# EAGLE design RH043.2 (EAGLE 7.7.0)
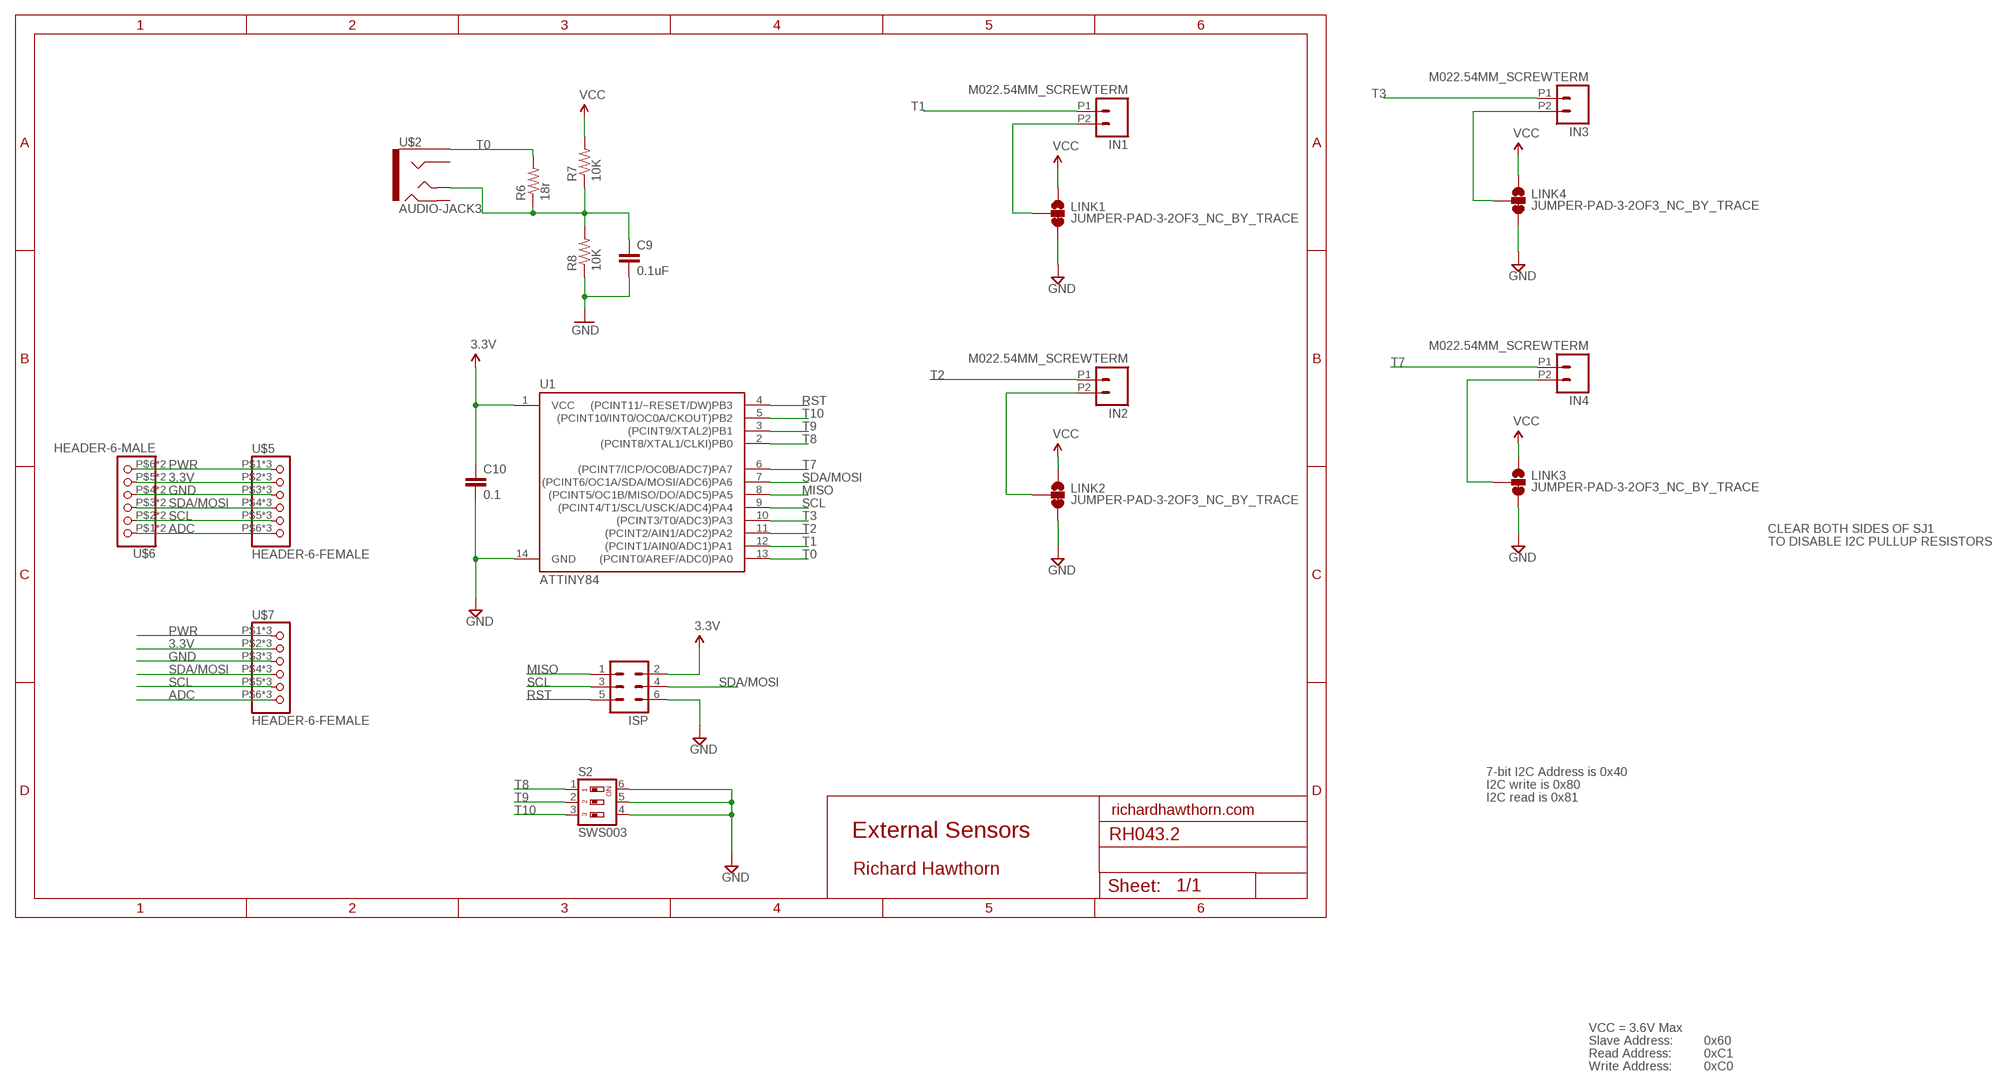
[diagram p0: schematic, sheet 1]

## Parts
C9  0.1uF  CAP0603-CAP  [0603-CAP]
C10  0.1  CAP0603-CAP  [0603-CAP]
IN1  M022.54MM_SCREWTERM  [1X02_2.54_SCREWTERM]
IN2  M022.54MM_SCREWTERM  [1X02_2.54_SCREWTERM]
IN3  M022.54MM_SCREWTERM  [1X02_2.54_SCREWTERM]
IN4  M022.54MM_SCREWTERM  [1X02_2.54_SCREWTERM]
ISP  MA03-2  [MA03-2]
LINK1  JUMPER-PAD-3-2OF3_NC_BY_TRACE  [PAD-JUMPER-3-2OF3_NC_BY_TRACE_YES_SILK_FULL_BOX]
LINK2  JUMPER-PAD-3-2OF3_NC_BY_TRACE  [PAD-JUMPER-3-2OF3_NC_BY_TRACE_YES_SILK_FULL_BOX]
LINK3  JUMPER-PAD-3-2OF3_NC_BY_TRACE  [PAD-JUMPER-3-2OF3_NC_BY_TRACE_YES_SILK_FULL_BOX]
LINK4  JUMPER-PAD-3-2OF3_NC_BY_TRACE  [PAD-JUMPER-3-2OF3_NC_BY_TRACE_YES_SILK_FULL_BOX]
R6  18r  RESISTOR0603-RES  [0603-RES]
R7  10K  RESISTOR0603-RES  [0603-RES]
R8  10K  RESISTOR0603-RES  [0603-RES]
S2  SWS003  [SMS-003]
U1  ATTINY84  [SO14]
U$2  AUDIO-JACK3  [AUDIO-JACK-TRRS-SMD]
U$5  HEADER-6-FEMALE  [2MMHEADER6]
U$6  HEADER-6-MALE  [2MMHEADERPIN6]
U$7  HEADER-6-FEMALE  [2MMHEADER6]

## Nets
3.3V: C10.1 ISP.2 LINK1.1 LINK2.1 LINK3.1 LINK4.1 R7.2 U1.1(VCC) U$5.P$2 U$5.P$10 U$5.P$18 U$6.P$5 U$6.P$13 U$7.P$2 U$7.P$10 U$7.P$18 ; supply symbol labelled VCC
ADC: U$5.P$6 U$5.P$14 U$5.P$22 U$6.P$1 U$6.P$9 U$7.P$6 U$7.P$14 U$7.P$22
GND [power]: C9.2 C10.2 ISP.6 LINK1.3 LINK2.3 LINK3.3 LINK4.3 R8.1 S2.4 S2.5 S2.6 U1.14(GND) U$5.P$3 U$5.P$11 U$5.P$19 U$6.P$4 U$6.P$12 U$7.P$3 U$7.P$11 U$7.P$19
MISO: ISP.1 U1.8((PCINT5/OC1B/MISO/DO/ADC5)PA5)
N$1 [power]: IN3.P2 LINK4.2
N$2 [power]: IN4.P2 LINK3.2
N$13 [power]: IN1.P2 LINK1.2
N$15 [power]: IN2.P2 LINK2.2
PWR [power]: U$5.P$1 U$5.P$9 U$5.P$17 U$6.P$6 U$6.P$14 U$7.P$1 U$7.P$9 U$7.P$17
R6: C9.1 R6.1 R7.1 R8.2 U$2.TIP
RST: ISP.5 U1.4((PCINT11/~RESET/DW)PB3)
SCL: ISP.3 U1.9((PCINT4/T1/SCL/USCK/ADC4)PA4) U$5.P$5 U$5.P$13 U$5.P$21 U$6.P$2 U$6.P$10 U$7.P$5 U$7.P$13 U$7.P$21
SDA/MOSI: ISP.4 U1.7((PCINT6/OC1A/SDA/MOSI/ADC6)PA6) U$5.P$4 U$5.P$12 U$5.P$20 U$6.P$3 U$6.P$11 U$7.P$4 U$7.P$12 U$7.P$20
T0: R6.2 U1.13((PCINT0/AREF/ADC0)PA0) U$2.EARTH
T1: IN1.P1 U1.12((PCINT1/AIN0/ADC1)PA1)
T2: IN2.P1 U1.11((PCINT2/AIN1/ADC2)PA2)
T3: IN3.P1 U1.10((PCINT3/T0/ADC3)PA3)
T7: IN4.P1 U1.6((PCINT7/ICP/OC0B/ADC7)PA7)
T8: S2.1 U1.2((PCINT8/XTAL1/CLKI)PB0)
T9: S2.2 U1.3((PCINT9/XTAL2)PB1)
T10: S2.3 U1.5((PCINT10/INT0/OC0A/CKOUT)PB2)
Unconnected: U$2.RING1 U$2.RING2

## Notes on the sheet
- CLEAR BOTH SIDES OF SJ1
- TO DISABLE I2C PULLUP RESISTORS
- 7-bit I2C Address is 0x40
- I2C write is 0x80
- I2C read is 0x81
- richardhawthorn.com
- External Sensors
- Richard Hawthorn
- VCC = 3.6V Max
- Slave Address: | 0x60
- Read Address: | 0xC1
- Write Address: | 0xC0

## Library data of the parts
C9 = SparkFun:CAP: Capacitor Standard 0603 ceramic capacitor, and 0.1" leaded capacitor.
C10 = LowPowerLab:CAP: Capacitor Standard 0603 ceramic capacitor, and 0.1" leaded capacitor.
IN1-IN4 = SparkFun-Connectors:M02: Standard 2-pin 0.1" header. Use with - straight break away headers ( PRT-00116) - right angle break away headers (PRT-00553) - swiss pins (PRT-00743) - machine pins (PRT-00117) - female headers (PRT-00115) Molex polarized connector foot print use with: PRT-08233 with associated crimp pins and housings. 2.54_SCREWTERM for use with PRT-10571. 3.5mm Screw Terminal footprints for PRT-08084 5mm Screw Terminal footprints for use with PRT-08432
ISP = Richards:MA03-2: PIN HEADER; OC_FARNELL: unknown; OC_NEWARK: unknown
LINK1-LINK4 = SparkFun-Passives:JUMPER-PAD-3-2OF3_NC_BY_TRACE
R6-R8 = SparkFun:RESISTOR: Resistor Basic schematic elements and footprints for 0603, 1206, and PTH resistors.
S2 = smd-special:SWS003: SMD Dip Switch 3 pol.
U1 = SparkFun-DigitalIC:ATTINY84: Atmel 14-pin 2/4/8kB flash uC
U$2 = SparkFun-Connectors:AUDIO-JACK3: Audio jack - 3.5mm TRRS variety - two rings.
U$5 U$7 = Richards:HEADER-6-FEMALE
U$6 = Richards:HEADER-6-MALE

## Net classes
1 power: width 0.381 mm, clearance 0.254 mm

## Board
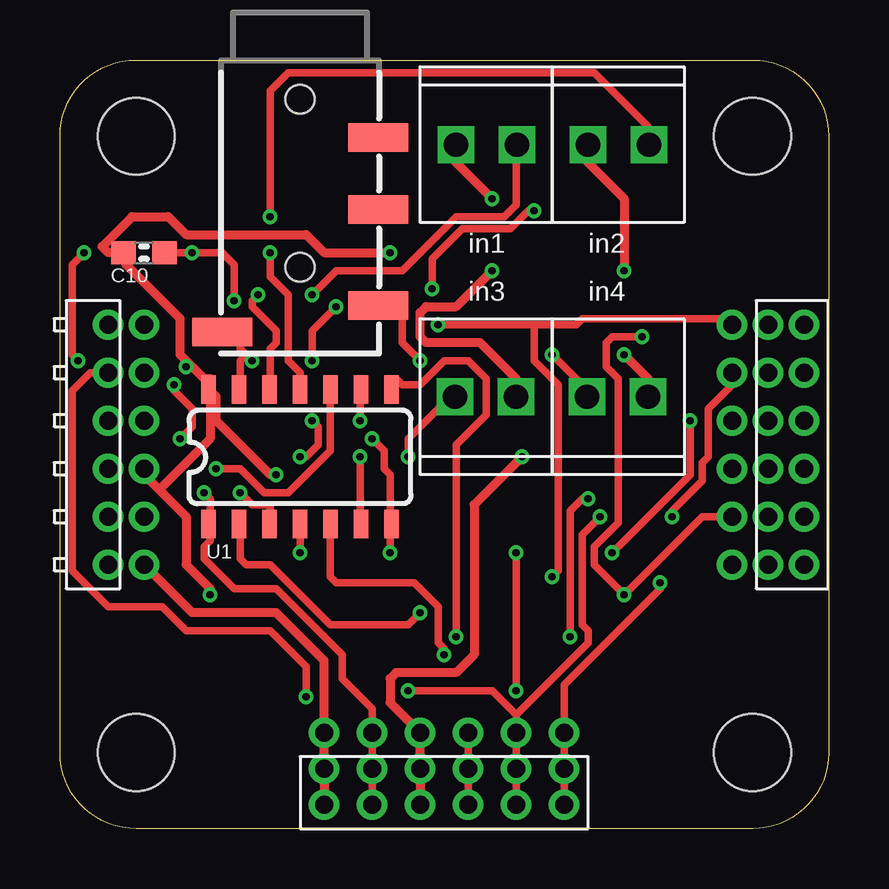
[diagram p1: board, top side]
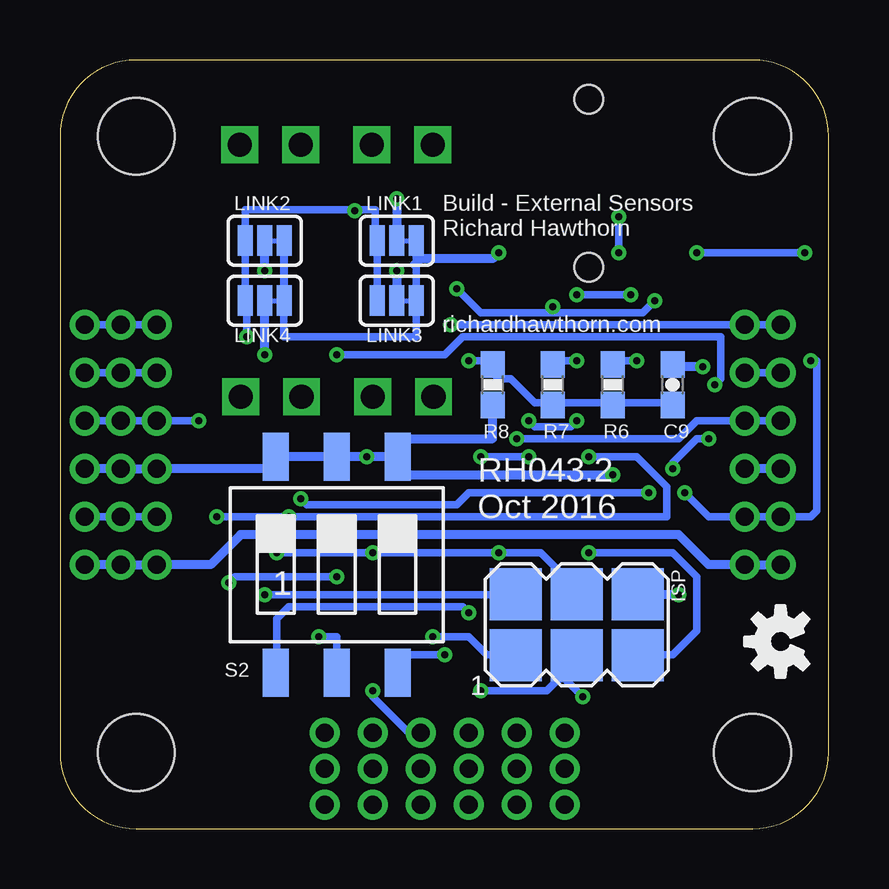
[diagram p2: board, bottom side, seen from below]

Size 32.03 x 32.03 mm. Coordinates in mm from the lower left corner, seen from the top.
Outline: 0,3.17 0,28.86 arc-90 3.17,32.03 28.86,32.03 arc-90 32.03,28.86 32.03,3.17 arc-90 28.86,0 3.17,0 arc-90 0,3.17
Copper layers (1*16): Top 0.035mm / dielectric 1.5mm / Bottom 0.035mm
Design rules "ITEADstudio_DRC *": minimum track width 12mil, minimum drill 12mil, track to track 6mil, track to pad 6mil, pad to pad 6mil, via to via 6mil, smd to smd 0mil, copper to edge 10mil, drill to drill 10mil, minimum pad ring 10mil, minimum via ring 6mil, stop-mask expansion 2mil, vias tented up to drill 100mil, thermal gap 15mil
Holes 3.2 mm at 3.17,3.17 28.86,3.17 3.17,28.86 28.86,28.86
tRestrict: area 0,0 to 5.7,5.7; area 26.3,0 to 32,5.7; area 26.3,26.3 to 32,32; area 0,26.3 to 5.7,32
bRestrict: area 0,26.3 to 5.7,32; area 26.3,26.3 to 32,32; area 26.3,0 to 32,5.7; area 0,0 to 5.7,5.7

### Footprints (pad centres in the part's own frame; a part is rotated, then mirrored left to right if it is on the bottom)
0603-CAP = smd 1.1 x 1: 1 -0.85,0; 2 0.85,0
0603-CAP' = smd 1.016 x 0.965: 1 -0.85,0; 2 0.85,0
1X02_2.54_SCREWTERM = drill 1.016 square: P1 2.54,0; P2 0,0
MA03-2 = smd 2.159 x 2.159: 1 -2.54,-1.27; 2 -2.54,1.27; 3 0,-1.27; 4 0,1.27; 5 2.54,-1.27; 6 2.54,1.27
PAD-JUMPER-3-2OF3_NC_BY_TRACE_YES_SILK_FULL_BOX = smd 0.635 x 1.27: 1 -0.813,0; 2 0,0; 3 0.813,0
0603-RES = smd 1.1 x 1: 1 -0.85,0; 2 0.85,0
SMS-003 = smd 1.092 x 2.007: 1 -2.54,-4.496; 2 0,-4.496; 3 2.54,-4.496; 4 2.54,4.496; 5 0,4.496; 6 -2.54,4.496
SO14 = smd 0.6 x 1.2: 1 -3.81,-2.8; 2 -2.54,-2.8; 3 -1.27,-2.8; 4 0,-2.8; 5 1.27,-2.8; 6 2.54,-2.8; 7 3.81,-2.8; 8 3.81,2.8; 9 2.54,2.8; 10 1.27,2.8; 11 0,2.8; 12 -1.27,2.8; 13 -2.54,2.8; 14 -3.81,2.8
AUDIO-JACK-TRRS-SMD = smd 1.2 x 2.5: EARTH 11.3,-3.25; RING1 6.2,3.25; RING2 3.2,3.25; TIP 10.2,3.25 | hole 1.2: 1.6,0; 8.6,0
2MMHEADER6 = drill 0.75: P$1 1,5; P$2 1,3; P$3 1,1; P$4 1,-1; P$5 1,-3; P$6 1,-5; P$9 -0.5,5; P$10 -0.5,3; P$11 -0.5,1; P$12 -0.5,-1; P$13 -0.5,-3; P$14 -0.5,-5; P$17 -2,5; P$18 -2,3; P$19 -2,1; P$20 -2,-1; P$21 -2,-3; P$22 -2,-5
2MMHEADERPIN6 = drill 0.75: P$1 1,5; P$2 1,3; P$3 1,1; P$4 1,-1; P$5 1,-3; P$6 1,-5; P$9 -0.5,5; P$10 -0.5,3; P$11 -0.5,1; P$12 -0.5,-1; P$13 -0.5,-3; P$14 -0.5,-5

### Placement (x,y rotation side)
C9  6.5,18.5 90 bottom
C10  0.1  [0603-CAP']  3.5,24 180 top
IN1  16.5,28.5 0 top
IN2  22,28.5 0 top
IN3  24.5,18 180 top
IN4  19,18 180 top
ISP  10.5,8.5 0 bottom
LINK1  18,24.5 0 bottom
LINK2  23.5,24.5 0 bottom
LINK3  18,22 0 bottom
LINK4  23.5,22 0 bottom
R6  9,18.5 90 bottom
R7  11.5,18.5 90 bottom
R8  14,18.5 90 bottom
S2  20.5,11 0 bottom
U1  10,15.5 0 top
U$2  10,32 270 top
U$3  [OSHW-LOGO-S]  2,7.8 90 bottom
U$5  16,3 90 top
U$6  2.5,16 0 top
U$7  29,16 180 top

### Tracks (layer width: path | path; a pad name or v marks a point on that pad's centre or on a via)
3.3V  (via drill 0.3)
  Top 0.305: U$5.P$18 U$5.P$10 U$5.P$2 13,5 11.75,6.25 11.75,7.25 9,10 7.25,10 6,11.25 6,11.75 6.25,12 6.25,12.5 U1.1 6.25,12.75 6.25,13.75 v6,14 | C10.1 v5.5,24 6.75,24 7.25,23.5 v7.25,22 | v15.5,22.5 15.5,23.75 16.75,25 18.75,25 19.5,25.75 v19.75,25.75 | v10.5,19.5 10.5,20.75 v11.5,21.75 | U$7.P$2 26.75,13 v23.5,9.75 22.25,11 22.25,11.75 23.25,12.75 23.25,18.75 22.75,19.25 22.75,20.25 23,20.5 v24.25,20.5 | v0.75,19.5 0.5,19.75 0.5,23.5 v1,24
  Bottom 0.305: LINK3.1 LINK1.1 18.9,24.5 18.9,25.8 19.75,25.8 | 19.75,25.8 24.31,25.8 LINK2.1 LINK4.1 24.25,22 v24.25,20.5 | v6,14 5,13 U$6.P$5 U$6.P$13 0.75,13 0.5,13.25 0.5,19.5 v0.75,19.5 | v7.25,22 7.75,21.5 11.5,21.5 | 11.5,21.5 14.5,21.5 v15.5,22.5 | v19.75,25.75 19.75,25.8 | v10.5,19.5 11.5,19.5 R7.2 | 11.5,21.5 v11.5,21.75 | v23.5,9.75 13.25,9.75 ISP.2 | U$7.P$2 U$7.P$10 U$7.P$18 | v5.5,24 v1,24
ADC  (via drill 0.3)
  Top 0.305: U$5.P$22 U$5.P$14 U$5.P$6 21,6 25,10 v25,10.25 | 19.75,21 21.5,21 21.75,21.25 27.75,21.25 U$7.P$6 | 19.75,21 v15.75,21 | v20.5,10.5 20.75,10.75 20.75,18.5 19.75,19.5 19.75,21
  Bottom 0.305: U$6.P$9 U$6.P$1 v15.75,21 | U$7.P$6 U$7.P$14 U$7.P$22 | v25,10.25 24.75,10.5 v20.5,10.5
GND  (via drill 0.3)
  Top 0.381: v6.25,9.75 6.25,10 5.25,11 5.25,13 4.12,14.12 | 4.12,14.12 3.5,14.75 U$6.P$4 | 5.38,19.38 6,18.75 6.25,18.75 6.25,18.5 U1.14 6.25,18.25 | 5.38,19.38 5,19.75 5,21.25 2.75,23.5 2.75,24 C10.2 2,24 1.75,24.25 3,25.5 4.5,25.5 5.25,24.75 10.25,24.75 11,24 v13.75,24 | v5.25,19.25 5.38,19.38 | 4.12,14.12 6.25,16.25 6.25,18.25 | U$5.P$19 U$5.P$11 U$5.P$3 13.75,5.25 13.75,6.25 14,6.5 16.5,6.5 17.25,7.25 17.25,13.5 v19.25,15.5 | 6.25,18.25 6.5,18 6.5,17 8.75,14.75 v9,14.75
  Bottom 0.305: LINK4.3 LINK2.3 22.7,20.5 17.19,20.5 LINK3.3 17.19,23.5 LINK1.3
  Bottom 0.381: U$6.P$12 U$6.P$4 | v6.25,9.75 7.75,9.75 ISP.6 | v5.25,19.25 6.5,19.25 C9.2 | v13.75,24 14,23.75 17,23.75 17.25,23.5 17.19,23.5 | U$7.P$19 U$7.P$11 U$7.P$3 23,15 23,15.25 S2.6 23,15.5 S2.5 | R8.1 14,16.25 17.75,16.25 18,16 18,15.5 | 18,15.5 v19.25,15.5 S2.5 | 18,15.5 S2.4 18,15.25 18,14.75 v9,14.75 | S2.5
MISO  (via drill 0.3)
  Top 0.305: v16.5,8 16.5,16 17.75,17.25 17.75,18.75 17,19.5 16,19.5 15,18.5 14.25,18.5 14,18.75 13.75,18.75 13.75,18.5 U1.8
  Bottom 0.305: v16.5,8 15,8 14.25,7.25 13.25,7.25 ISP.1
N$1  (via drill 0.3)
  Top 0.381: v23.5,19.75 24.5,18.75 IN3.P2
  Bottom 0.381: v23.5,19.75 LINK4.2
N$2  (via drill 0.3)
  Top 0.381: v18,23.25 16.5,21.75 15.25,21.75 15,21.5 15,20.5 15.25,20.25 17.5,20.25 19,18.75 IN4.P2
  Bottom 0.381: v18,23.25 LINK3.2
N$13  (via drill 0.3)
  Top 0.381: v18,26.25 16.5,27.75 IN1.P2
  Bottom 0.381: v18,26.25 LINK1.2
N$15  (via drill 0.3)
  Top 0.381: v23.5,23.25 23.5,26.25 22,27.75 IN2.P2
  Bottom 0.381: v23.5,23.25 LINK2.2
PWR
  Top 0.381: U$5.P$17 U$5.P$9 U$5.P$1 11,7 9,9 5.5,9 U$6.P$6
  Bottom 0.381: U$7.P$17 U$7.P$9 U$7.P$1 25.75,11 24.5,12.25 6.25,12.25 5,11 U$6.P$6 U$6.P$14
R6  (via drill 0.3)
  Top 0.305: v15,19.5 14.25,20.25 14.25,21.5 14,21.75 13.25,21.75 U$2.TIP
  Bottom 0.305: 9,17.75 6.5,17.75 C9.1 | 9,17.75 11.5,17.75 | 9,17.75 R6.1 | v15,19.5 14,19.5 R8.2 14,19 13.75,18.75 13.25,18.75 12.25,17.75 11.5,17.75 | 11.5,17.75 R7.1
RST  (via drill 0.3)
  Top 0.305: U1.4 v10,11.5
  Bottom 0.305: v10,11.5 6.5,11.5 5.5,10.5 5.5,8.25 6.5,7.25 7.75,7.25 ISP.5
SCL  (via drill 0.3)
  Top 0.305: v12.5,17 12.5,18.25 U1.9 | v10.5,17 10.75,16.75 10.75,16 10.25,15.5 v10,15.5 | v22.5,13 21.75,12.25 21.75,8.5 22,8.25 22,7.75 19,4.75 | 19,4.75 U$5.P$5 U$5.P$13 U$5.P$21 | v14.5,5.75 18,5.75 19,4.75 | U$6.P$10 1.25,19 0.5,18.25 0.5,10.75 2,9.25 4.25,9.25 5.25,8.25 8.75,8.25 10.25,6.75 v10.25,5.5 | U$7.P$5 28,18.5 27,17.5 27,15.5 26.75,15.25 26.75,14.5 25.5,13.25 v25.5,13
  Bottom 0.305: U$7.P$5 U$7.P$13 U$7.P$21 | U$6.P$2 U$6.P$10 | v12.5,17 12.25,16.75 10.75,16.75 v10.5,17 | v10,15.5 8,15.5 6.75,14.25 6.75,13 v22.5,13 v25.5,13 | 11.25,6.25 11.75,5.75 v14.5,5.75 | 11.25,6.25 10.5,7 ISP.3 11.25,6.25 | v10.25,5.5 11,6.25 11.25,6.25
SDA/MOSI  (via drill 0.3)
  Top 0.305: U$5.P$4 U$5.P$12 U$5.P$20 | v13.75,11.5 13.75,12.5 U1.7 13.75,12.75 13.75,14.75 13.5,15 13.5,15.75 v13,16.25 | v19,11.5 v19,5.75 | v26.25,17 26.25,14.75 v23,11.5
  Bottom 0.305: U$7.P$20 U$7.P$12 U$7.P$4 v26.25,17 | U$6.P$11 U$6.P$3 5.5,17 6.25,16.25 v13,16.25 | ISP.4 10.5,10 12,11.5 v13.75,11.5 v19,11.5 v23,11.5 | U$5.P$4 17.5,4 19,5.5 v19,5.75
T0  (via drill 0.3)
  Top 0.305: 7.75,19.75 v8,19.5 | 7.75,19.75 7.5,19.5 7.5,18.5 U1.13 | 7.75,19.75 7.5,20 7.5,20.75 6.75,20.75 U$2.EARTH
  Bottom 0.305: v8,19.5 9,19.5 R6.2
T1  (via drill 0.3)
  Top 0.305: v10.5,22.25 11.5,23.25 14.25,23.25 16.5,25.5 18.5,25.5 19,26 19,28.5 IN1.P1 | v8.25,22.25 8,22 8,21.75 9,20.75 9,20.25 8.75,20 8.75,18.5 U1.12
  Bottom 0.305: v8.25,22.25 v10.5,22.25
T2  (via drill 0.3)
  Top 0.305: U1.11 10,19 9.5,19.5 9.5,22.25 8.75,23 v8.75,24 | v8.75,25.5 8.75,30.75 9.5,31.5 22.25,31.5 24.5,29.25 24.5,28.5 IN2.P1
  Bottom 0.305: v8.75,25.5 v8.75,24
T3  (via drill 0.3)
  Top 0.305: v6.5,15 7.5,15 8.5,14 9.5,14 11.25,15.75 11.25,18.25 U1.10 | v5,16.25 5.5,16.75 5.5,17.5 4.75,18.25 v4.75,18.5 | v20.5,19.75 21.75,18.5 21.75,18 IN3.P1
  Bottom 0.305: v6.5,15 6.5,15.25 5.5,16.25 v5,16.25 | v4.75,18.5 4.5,18.75 4.5,20.5 15.25,20.5 16,19.75 v20.5,19.75
T7  (via drill 0.3)
  Top 0.305: v12.5,15.5 12.5,12.75 U1.6 | v14.5,15.5 14.5,16.25 16.25,18 IN4.P1
  Bottom 0.305: v14.5,15.5 v12.5,15.5
T8  (via drill 0.3)
  Top 0.305: v15,9 14.5,8.5 11.25,8.5 8.75,11 7.75,11 7.5,11.25 7.5,12.5 U1.2
  Bottom 0.305: v15,9 15.25,9.25 22.5,9.25 23,8.75 23,6.75 S2.1
T9  (via drill 0.3)
  Top 0.305: v21.25,8 21.25,13.25 21.75,13.75 v22,13.75 | v7.5,14 8,13.5 8.75,13.5 8.75,12.75 U1.3
  Bottom 0.305: S2.2 20.5,8 v21.25,8 | v22,13.75 21.75,13.5 15.5,13.5 15,14 v7.5,14
T10  (via drill 0.3)
  Top 0.305: v16,7.25 16,7.5 15.75,7.75 15.75,9.25 14.75,10.25 11.5,10.25 11.25,10.5 11.25,12.5 U1.5
  Bottom 0.305: v16,7.25 18,7.25 18,6.75 S2.3

### Text on the board
tPlace: in1 | in2 | in3 | in4
bPlace: Build - External Sensors / Richard Hawthorn | richardhawthorn.com | RH043.2 / Oct 2016
tDocu: REG